# Altium schematic sheet 03_DO.SchDoc
size 444 x 254 mm
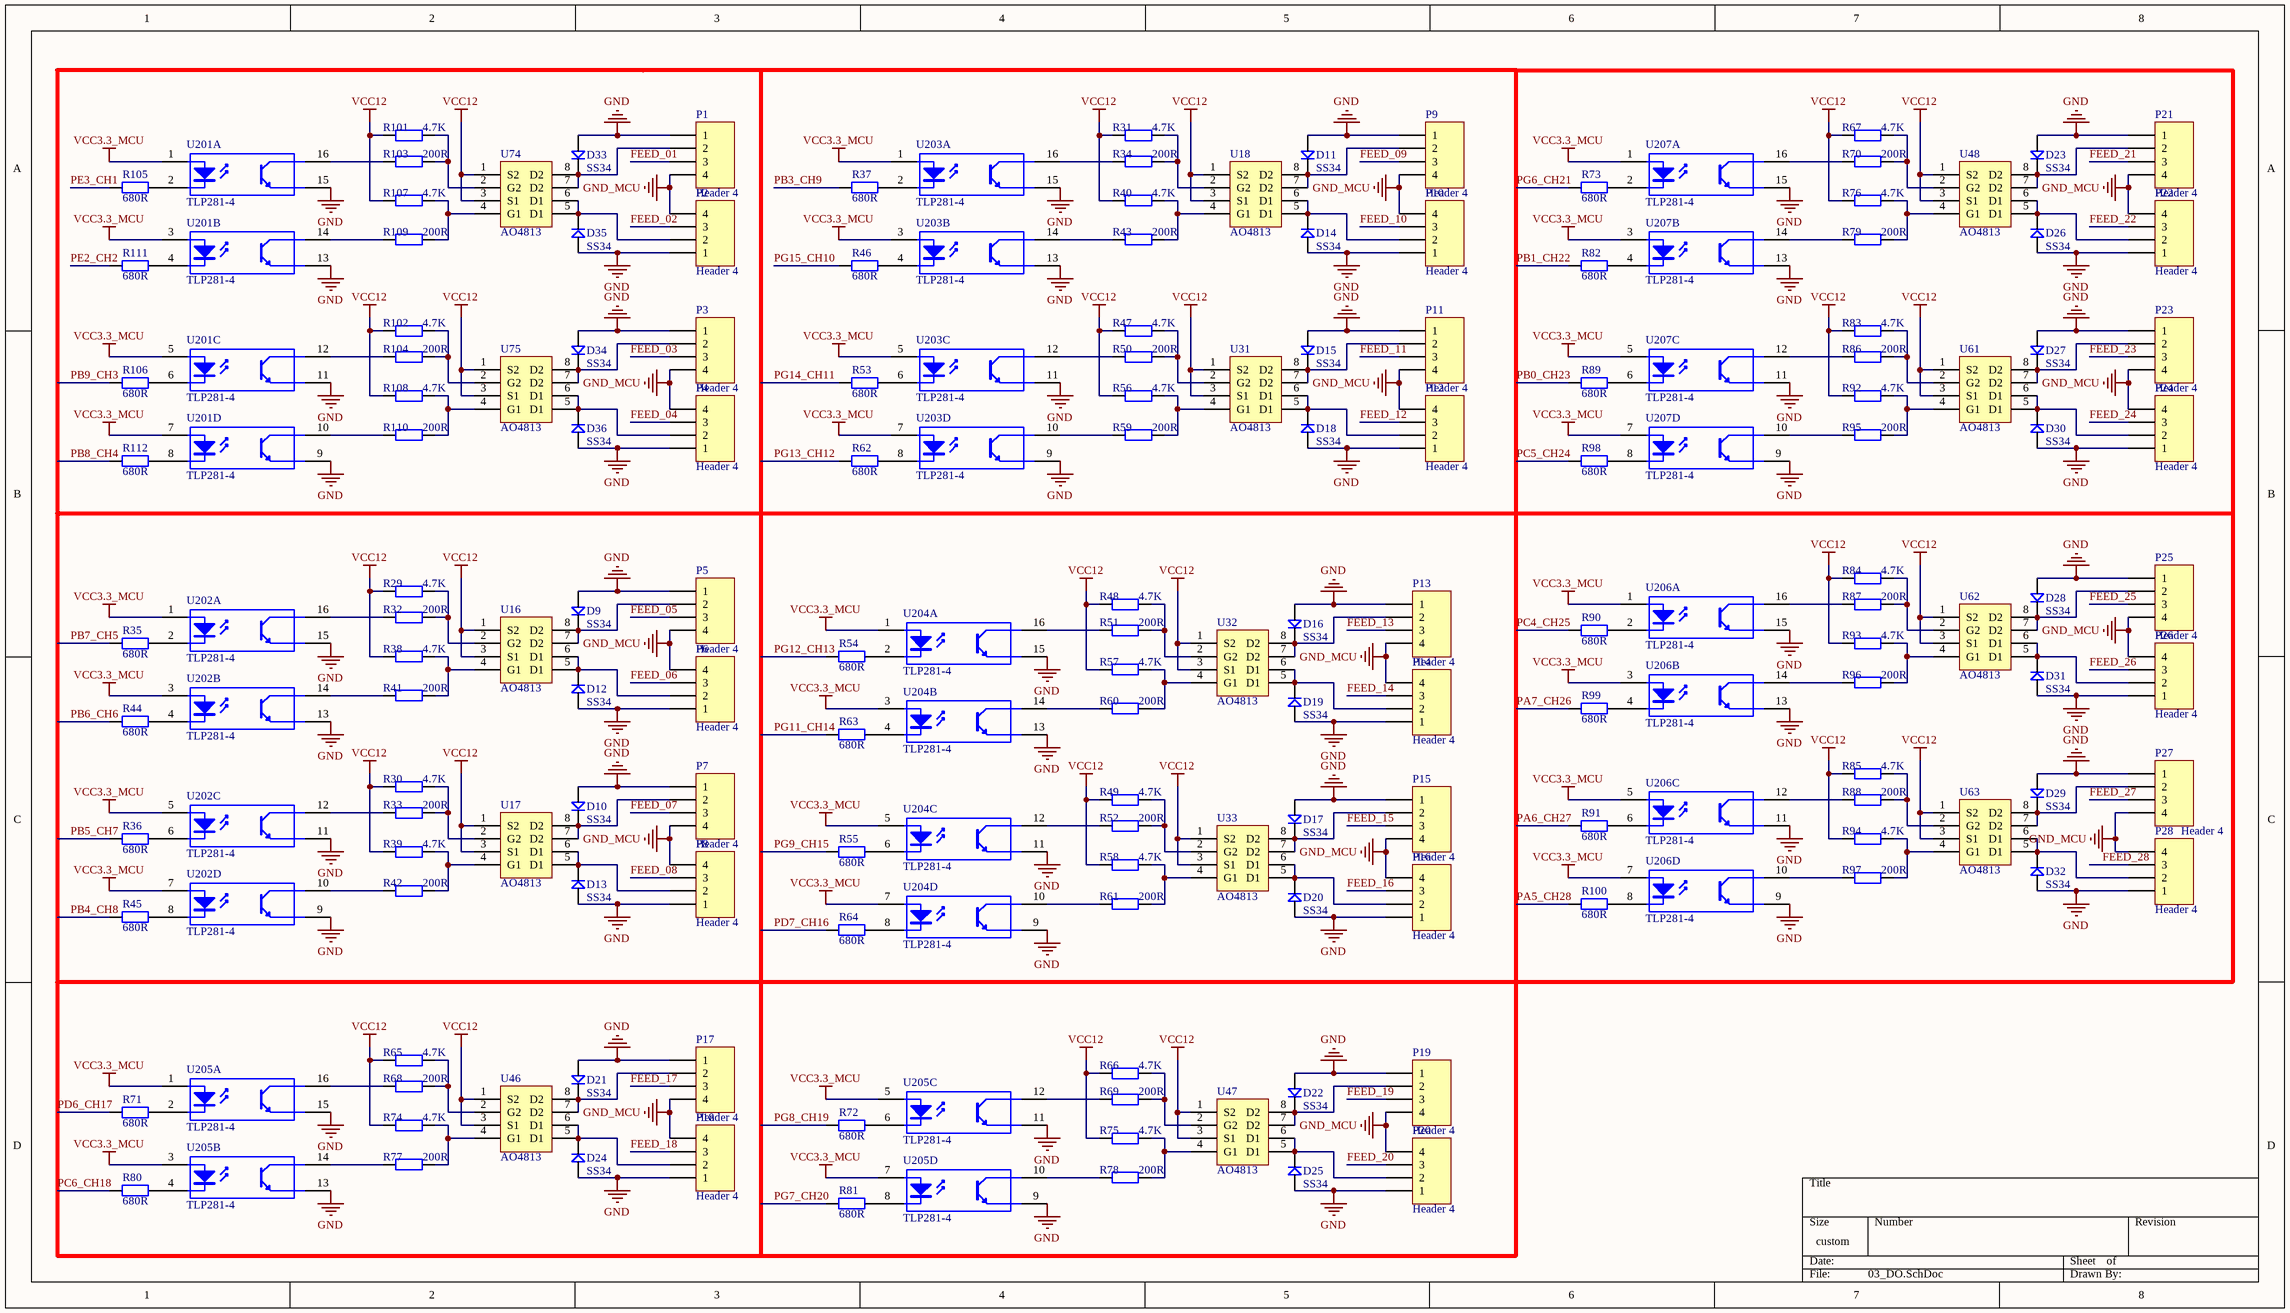
[diagram p0: 03_DO.SchDoc]

## Parts
D9  SS34  [D1812]
D10  SS34  [D1812]
D11  SS34  [D1812]
D12  SS34  [D1812]
D13  SS34  [D1812]
D14  SS34  [D1812]
D15  SS34  [D1812]
D16  SS34  [D1812]
D17  SS34  [D1812]
D18  SS34  [D1812]
D19  SS34  [D1812]
D20  SS34  [D1812]
D21  SS34  [D1812]
D22  SS34  [D1812]
D23  SS34  [D1812]
D24  SS34  [D1812]
D25  SS34  [D1812]
D26  SS34  [D1812]
D27  SS34  [D1812]
D28  SS34  [D1812]
D29  SS34  [D1812]
D30  SS34  [D1812]
D31  SS34  [D1812]
D32  SS34  [D1812]
D33  SS34  [D1812]
D34  SS34  [D1812]
D35  SS34  [D1812]
D36  SS34  [D1812]
P1  Header 4  [XH2.54-1*10]
P2  Header 4  [XH2.54-1*10]
P3  Header 4  [XH2.54-1*10]
P4  Header 4  [XH2.54-1*10]
P5  Header 4  [XH2.54-1*10]
P6  Header 4  [XH2.54-1*10]
P7  Header 4  [XH2.54-1*10]
P8  Header 4  [XH2.54-1*10]
P9  Header 4  [XH2.54-1*10]
P10  Header 4  [XH2.54-1*10]
P11  Header 4  [XH2.54-1*10]
P12  Header 4  [XH2.54-1*10]
P13  Header 4  [XH2.54-1*10]
P14  Header 4  [XH2.54-1*10]
P15  Header 4  [XH2.54-1*10]
P16  Header 4  [XH2.54-1*10]
P17  Header 4  [XH2.54-1*10]
P18  Header 4  [XH2.54-1*10]
P19  Header 4  [XH2.54-1*10]
P20  Header 4  [XH2.54-1*10]
P21  Header 4  [XH2.54-1*10]
P22  Header 4  [XH2.54-1*10]
P23  Header 4  [XH2.54-1*10]
P24  Header 4  [XH2.54-1*10]
P25  Header 4  [XH2.54-1*10]
P26  Header 4  [XH2.54-1*10]
P27  Header 4  [XH2.54-1*10]
P28  Header 4  [XH2.54-1*10]
R29  4.7K  [0603R]
R30  4.7K  [0603R]
R31  4.7K  [0603R]
R32  200R  [0603R]
R33  200R  [0603R]
R34  200R  [0603R]
R35  680R  [0603R]
R36  680R  [0603R]
R37  680R  [0603R]
R38  4.7K  [0603R]
R39  4.7K  [0603R]
R40  4.7K  [0603R]
R41  200R  [0603R]
R42  200R  [0603R]
R43  200R  [0603R]
R44  680R  [0603R]
R45  680R  [0603R]
R46  680R  [0603R]
R47  4.7K  [0603R]
R48  4.7K  [0603R]
R49  4.7K  [0603R]
R50  200R  [0603R]
R51  200R  [0603R]
R52  200R  [0603R]
R53  680R  [0603R]
R54  680R  [0603R]
R55  680R  [0603R]
R56  4.7K  [0603R]
R57  4.7K  [0603R]
R58  4.7K  [0603R]
R59  200R  [0603R]
R60  200R  [0603R]
R61  200R  [0603R]
R62  680R  [0603R]
R63  680R  [0603R]
R64  680R  [0603R]
R65  4.7K  [0603R]
R66  4.7K  [0603R]
R67  4.7K  [0603R]
R68  200R  [0603R]
R69  200R  [0603R]
R70  200R  [0603R]
R71  680R  [0603R]
R72  680R  [0603R]
R73  680R  [0603R]
R74  4.7K  [0603R]
R75  4.7K  [0603R]
R76  4.7K  [0603R]
R77  200R  [0603R]
R78  200R  [0603R]
R79  200R  [0603R]
R80  680R  [0603R]
R81  680R  [0603R]
R82  680R  [0603R]
R83  4.7K  [0603R]
R84  4.7K  [0603R]
R85  4.7K  [0603R]
R86  200R  [0603R]
R87  200R  [0603R]
R88  200R  [0603R]
R89  680R  [0603R]
R90  680R  [0603R]
R91  680R  [0603R]
R92  4.7K  [0603R]
R93  4.7K  [0603R]
R94  4.7K  [0603R]
R95  200R  [0603R]
R96  200R  [0603R]
R97  200R  [0603R]
R98  680R  [0603R]
R99  680R  [0603R]
R100  680R  [0603R]
R101  4.7K  [0603R]
R102  4.7K  [0603R]
R103  200R  [0603R]
R104  200R  [0603R]
R105  680R  [0603R]
R106  680R  [0603R]
R107  4.7K  [0603R]
R108  4.7K  [0603R]
R109  200R  [0603R]
R110  200R  [0603R]
R111  680R  [0603R]
R112  680R  [0603R]
U16  AO4813  [SO-8]
U17  AO4813  [SO-8]
U18  AO4813  [SO-8]
U31  AO4813  [SO-8]
U32  AO4813  [SO-8]
U33  AO4813  [SO-8]
U46  AO4813  [SO-8]
U47  AO4813  [SO-8]
U48  AO4813  [SO-8]
U61  AO4813  [SO-8]
U62  AO4813  [SO-8]
U63  AO4813  [SO-8]
U74  AO4813  [SO-8]
U75  AO4813  [SO-8]
U201  TLP281-4  [SO-16]  (parts A,B,C,D of 4)
U202  TLP281-4  [SO-16]  (parts A,B,C,D of 4)
U203  TLP281-4  [SO-16]  (parts A,B,C,D of 4)
U204  TLP281-4  [SO-16]  (parts A,B,C,D of 4)
U205  TLP281-4  [SO-16]  (parts A,B,C,D of 4)
U206  TLP281-4  [SO-16]  (parts A,B,C,D of 4)
U207  TLP281-4  [SO-16]  (parts A,B,C,D of 4)

## Nets
GND: D9.1 D10.1 D11.1 D12.1 D13.1 D14.1 D15.1 D16.1 D17.1 D18.1 D19.1 D20.1 D21.1 D22.1 D23.1 D24.1 D25.1 D26.1 D27.1 D28.1 D29.1 D30.1 D31.1 D32.1 D33.1 D34.1 D35.1 D36.1 P1.1 P2.1 P3.1 P4.1 P5.1 P6.1 P7.1 P8.1 P9.1 P10.1 P11.1 P12.1 P13.1 P14.1 P15.1 P16.1 P17.1 P18.1 P19.1 P20.1 P21.1 P22.1 P23.1 P24.1 P25.1 P26.1 P27.1 P28.1 U201.9(E) U201.11(E) U201.13(E) U201.15(E) U202.9(E) U202.11(E) U202.13(E) U202.15(E) U203.9(E) U203.11(E) U203.13(E) U203.15(E) U204.9(E) U204.11(E) U204.13(E) U204.15(E) U205.9(E) U205.11(E) U205.13(E) U205.15(E) U206.9(E) U206.11(E) U206.13(E) U206.15(E) U207.9(E) U207.11(E) U207.13(E) U207.15(E)
GND_MCU: P1.4 P2.4 P3.4 P4.4 P5.4 P6.4 P7.4 P8.4 P9.4 P10.4 P11.4 P12.4 P13.4 P14.4 P15.4 P16.4 P17.4 P18.4 P19.4 P20.4 P21.4 P22.4 P23.4 P24.4 P25.4 P26.4 P27.4 P28.4
VCC3.3_MCU: U201.1(A) U201.3(A) U201.5(A) U201.7(A) U202.1(A) U202.3(A) U202.5(A) U202.7(A) U203.1(A) U203.3(A) U203.5(A) U203.7(A) U204.1(A) U204.3(A) U204.5(A) U204.7(A) U205.1(A) U205.3(A) U205.5(A) U205.7(A) U206.1(A) U206.3(A) U206.5(A) U206.7(A) U207.1(A) U207.3(A) U207.5(A) U207.7(A)
VCC12: R29.2 R30.2 R31.2 R38.2 R39.2 R40.2 R47.2 R48.2 R49.2 R56.2 R57.2 R58.2 R65.2 R66.2 R67.2 R74.2 R75.2 R76.2 R83.2 R84.2 R85.2 R92.2 R93.2 R94.2 R101.2 R102.2 R107.2 R108.2 U16.1(S2) U16.3(S1) U17.1(S2) U17.3(S1) U18.1(S2) U18.3(S1) U31.1(S2) U31.3(S1) U32.1(S2) U32.3(S1) U33.1(S2) U33.3(S1) U46.1(S2) U46.3(S1) U47.1(S2) U47.3(S1) U48.1(S2) U48.3(S1) U61.1(S2) U61.3(S1) U62.1(S2) U62.3(S1) U63.1(S2) U63.3(S1) U74.1(S2) U74.3(S1) U75.1(S2) U75.3(S1)
FEED_01: P1.3
FEED_02: P2.3
FEED_03: P3.3
FEED_04: P4.3
FEED_05: P5.3
FEED_06: P6.3
FEED_07: P7.3
FEED_08: P8.3
FEED_09: P9.3
FEED_10: P10.3
FEED_11: P11.3
FEED_12: P12.3
FEED_13: P13.3
FEED_14: P14.3
FEED_15: P15.3
FEED_16: P16.3
FEED_17: P17.3
FEED_18: P18.3
FEED_19: P19.3
FEED_20: P20.3
FEED_21: P21.3
FEED_22: P22.3
FEED_23: P23.3
FEED_24: P24.3
FEED_25: P25.3
FEED_26: P26.3
FEED_27: P27.3
FEED_28: P28.3
PA5_CH28: R100.1
PA6_CH27: R91.1
PA7_CH26: R99.1
PB0_CH23: R89.1
PB1_CH22: R82.1
PB3_CH9: R37.1
PB4_CH8: R45.1
PB5_CH7: R36.1
PB6_CH6: R44.1
PB7_CH5: R35.1
PB8_CH4: R112.1
PB9_CH3: R106.1
PC4_CH25: R90.1
PC5_CH24: R98.1
PC6_CH18: R80.1
PD6_CH17: R71.1
PD7_CH16: R64.1
PE2_CH2: R111.1
PE3_CH1: R105.1
PG6_CH21: R73.1
PG7_CH20: R81.1
PG8_CH19: R72.1
PG9_CH15: R55.1
PG11_CH14: R63.1
PG12_CH13: R54.1
PG13_CH12: R62.1
PG14_CH11: R53.1
PG15_CH10: R46.1
NetD9_2: D9.2 P5.2 U16.7(D2) U16.8(D2)
NetD10_2: D10.2 P7.2 U17.7(D2) U17.8(D2)
NetD11_2: D11.2 P9.2 U18.7(D2) U18.8(D2)
NetD12_2: D12.2 P6.2 U16.5(D1) U16.6(D1)
NetD13_2: D13.2 P8.2 U17.5(D1) U17.6(D1)
NetD14_2: D14.2 P10.2 U18.5(D1) U18.6(D1)
NetD15_2: D15.2 P11.2 U31.7(D2) U31.8(D2)
NetD16_2: D16.2 P13.2 U32.7(D2) U32.8(D2)
NetD17_2: D17.2 P15.2 U33.7(D2) U33.8(D2)
NetD18_2: D18.2 P12.2 U31.5(D1) U31.6(D1)
NetD19_2: D19.2 P14.2 U32.5(D1) U32.6(D1)
NetD20_2: D20.2 P16.2 U33.5(D1) U33.6(D1)
NetD21_2: D21.2 P17.2 U46.7(D2) U46.8(D2)
NetD22_2: D22.2 P19.2 U47.7(D2) U47.8(D2)
NetD23_2: D23.2 P21.2 U48.7(D2) U48.8(D2)
NetD24_2: D24.2 P18.2 U46.5(D1) U46.6(D1)
NetD25_2: D25.2 P20.2 U47.5(D1) U47.6(D1)
NetD26_2: D26.2 P22.2 U48.5(D1) U48.6(D1)
NetD27_2: D27.2 P23.2 U61.7(D2) U61.8(D2)
NetD28_2: D28.2 P25.2 U62.7(D2) U62.8(D2)
NetD29_2: D29.2 P27.2 U63.7(D2) U63.8(D2)
NetD30_2: D30.2 P24.2 U61.5(D1) U61.6(D1)
NetD31_2: D31.2 P26.2 U62.5(D1) U62.6(D1)
NetD32_2: D32.2 P28.2 U63.5(D1) U63.6(D1)
NetD33_2: D33.2 P1.2 U74.7(D2) U74.8(D2)
NetD34_2: D34.2 P3.2 U75.7(D2) U75.8(D2)
NetD35_2: D35.2 P2.2 U74.5(D1) U74.6(D1)
NetD36_2: D36.2 P4.2 U75.5(D1) U75.6(D1)
NetR29_1: R29.1 R32.2 U16.2(G2)
NetR30_1: R30.1 R33.2 U17.2(G2)
NetR31_1: R31.1 R34.2 U18.2(G2)
NetR32_1: R32.1 U202.16(C)
NetR33_1: R33.1 U202.12(C)
NetR34_1: R34.1 U203.16(C)
NetR35_2: R35.2 U202.2(K)
NetR36_2: R36.2 U202.6(K)
NetR37_2: R37.2 U203.2(K)
NetR38_1: R38.1 R41.2 U16.4(G1)
NetR39_1: R39.1 R42.2 U17.4(G1)
NetR40_1: R40.1 R43.2 U18.4(G1)
NetR41_1: R41.1 U202.14(C)
NetR42_1: R42.1 U202.10(C)
NetR43_1: R43.1 U203.14(C)
NetR44_2: R44.2 U202.4(K)
NetR45_2: R45.2 U202.8(K)
NetR46_2: R46.2 U203.4(K)
NetR47_1: R47.1 R50.2 U31.2(G2)
NetR48_1: R48.1 R51.2 U32.2(G2)
NetR49_1: R49.1 R52.2 U33.2(G2)
NetR50_1: R50.1 U203.12(C)
NetR51_1: R51.1 U204.16(C)
NetR52_1: R52.1 U204.12(C)
NetR53_2: R53.2 U203.6(K)
NetR54_2: R54.2 U204.2(K)
NetR55_2: R55.2 U204.6(K)
NetR56_1: R56.1 R59.2 U31.4(G1)
NetR57_1: R57.1 R60.2 U32.4(G1)
NetR58_1: R58.1 R61.2 U33.4(G1)
NetR59_1: R59.1 U203.10(C)
NetR60_1: R60.1 U204.14(C)
NetR61_1: R61.1 U204.10(C)
NetR62_2: R62.2 U203.8(K)
NetR63_2: R63.2 U204.4(K)
NetR64_2: R64.2 U204.8(K)
NetR65_1: R65.1 R68.2 U46.2(G2)
NetR66_1: R66.1 R69.2 U47.2(G2)
NetR67_1: R67.1 R70.2 U48.2(G2)
NetR68_1: R68.1 U205.16(C)
NetR69_1: R69.1 U205.12(C)
NetR70_1: R70.1 U207.16(C)
NetR71_2: R71.2 U205.2(K)
NetR72_2: R72.2 U205.6(K)
NetR73_2: R73.2 U207.2(K)
NetR74_1: R74.1 R77.2 U46.4(G1)
NetR75_1: R75.1 R78.2 U47.4(G1)
NetR76_1: R76.1 R79.2 U48.4(G1)
NetR77_1: R77.1 U205.14(C)
NetR78_1: R78.1 U205.10(C)
NetR79_1: R79.1 U207.14(C)
NetR80_2: R80.2 U205.4(K)
NetR81_2: R81.2 U205.8(K)
NetR82_2: R82.2 U207.4(K)
NetR83_1: R83.1 R86.2 U61.2(G2)
NetR84_1: R84.1 R87.2 U62.2(G2)
NetR85_1: R85.1 R88.2 U63.2(G2)
NetR86_1: R86.1 U207.12(C)
NetR87_1: R87.1 U206.16(C)
NetR88_1: R88.1 U206.12(C)
NetR89_2: R89.2 U207.6(K)
NetR90_2: R90.2 U206.2(K)
NetR91_2: R91.2 U206.6(K)
NetR92_1: R92.1 R95.2 U61.4(G1)
NetR93_1: R93.1 R96.2 U62.4(G1)
NetR94_1: R94.1 R97.2 U63.4(G1)
NetR95_1: R95.1 U207.10(C)
NetR96_1: R96.1 U206.14(C)
NetR97_1: R97.1 U206.10(C)
NetR98_2: R98.2 U207.8(K)
NetR99_2: R99.2 U206.4(K)
NetR100_2: R100.2 U206.8(K)
NetR101_1: R101.1 R103.2 U74.2(G2)
NetR102_1: R102.1 R104.2 U75.2(G2)
NetR103_1: R103.1 U201.16(C)
NetR104_1: R104.1 U201.12(C)
NetR105_2: R105.2 U201.2(K)
NetR106_2: R106.2 U201.6(K)
NetR107_1: R107.1 R109.2 U74.4(G1)
NetR108_1: R108.1 R110.2 U75.4(G1)
NetR109_1: R109.1 U201.14(C)
NetR110_1: R110.1 U201.10(C)
NetR111_2: R111.2 U201.4(K)
NetR112_2: R112.2 U201.8(K)

## Library data of the parts
D9-D36 = D
P1-P28 = Header 4: Header, 4-Pin; LatestRevisionDate: 17-Jul-2002; LatestRevisionNote: Re-released for DXP Platform.; Publisher: Altium Limited
R29-R112 = 0603 2.7KΩ (2701) 1%: 贴片电阻; ComponentLink1Description: 供应商链接; ComponentLink1URL: http://www.szlcsc.com/product/details_13814.html; Package: 0603; Supplier: LC; SuppliersPartNumber: C13167
U16-U18 U31-U33 U46-U48 U61-U63 U74 U75 = NDS8434
U201-U207 = TP521-4_1